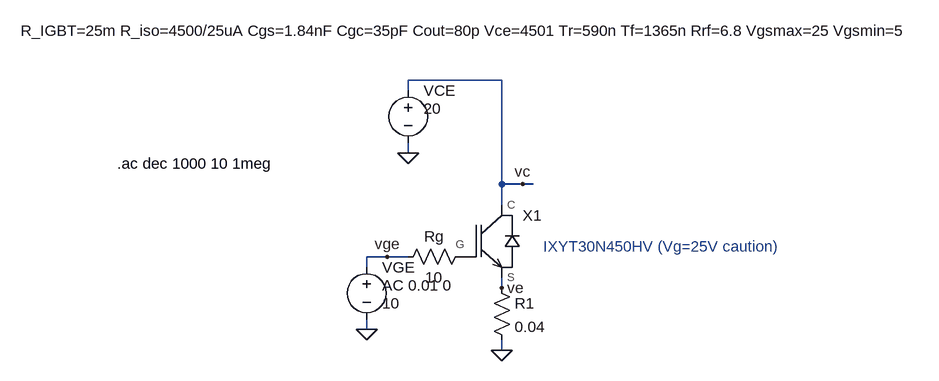
[diagram p0: schematic analisis_AC_IGBT.asc]
analisis_AC_IGBT.asc, the LTspice schematic file:
Version 4
SHEET 1 2256 680
WIRE 672 -112 528 -112
WIRE 528 -96 528 -112
WIRE 528 0 528 -16
WIRE 672 48 672 -112
WIRE 704 48 672 48
WIRE 720 48 704 48
WIRE 672 80 672 48
WIRE 496 160 464 160
WIRE 528 160 496 160
WIRE 464 176 464 160
WIRE 672 208 672 192
WIRE 464 272 464 256
WIRE 672 304 672 288
FLAG 528 0 0
FLAG 672 304 0
FLAG 464 272 0
FLAG 496 160 vge
FLAG 704 48 vc
FLAG 672 208 ve
SYMBOL voltage 464 160 R0
WINDOW 123 24 44 Left 2
WINDOW 39 0 0 Left 0
WINDOW 3 24 72 Left 2
SYMATTR Value2 AC 0.01 0
SYMATTR InstName VGE
SYMATTR Value 10
SYMBOL voltage 528 -112 R0
WINDOW 3 24 44 Left 2
WINDOW 123 0 0 Left 0
WINDOW 39 0 0 Left 0
SYMATTR Value 20
SYMATTR InstName VCE
SYMBOL IGBT_model 640 176 R0
WINDOW 39 -708 -364 Left 2
SYMATTR SpiceLine R_IGBT=25m R_iso=4500/25uA Cgs=1.84nF Cgc=35pF Cout=80p Vce=4501 Tr=590n Tf=1365n Rrf=6.8 Vgsmax=25 Vgsmin=5
SYMATTR InstName X1
SYMBOL res 624 144 R90
WINDOW 0 0 56 VBottom 2
WINDOW 3 32 56 VTop 2
SYMATTR InstName Rg
SYMATTR Value 10
SYMBOL res 656 192 R0
SYMATTR InstName R1
SYMATTR Value 0.04
TEXT 736 144 Left 2 ;IXYT30N450HV (Vg=25V caution)
TEXT 80 16 Left 2 !.ac dec 1000 10 1meg

The netlist it stands for:
* analisis_AC_IGBT.asc
VGE vge 0 10 AC 0.01 0
VCE vc 0 20
XX1 vc P001 ve IGBT_model params: R_IGBT=25m R_iso=4500/25uA Cgs=1.84nF Cgc=35pF Cout=80p Vce=4501 Tr=590n Tf=1365n Rrf=6.8 Vgsmax=25 Vgsmin=5  ; pins C G S
Rg P001 vge 10
R1 ve 0 0.04
* IXYT30N450HV (Vg=25V caution)
.ac dec 1000 10 1meg
.backanno
.end

* Results of the author's LTspice run, read from the files saved beside the schematic
* Operating Point, zero values left out:
*   V(vge) = 10 V
*   V(vc) = 20 V
*   V(ve) = 2.889 V
*   V(p001) = 10 V
*   I(R1) = 72.23 A
*   I(Vce) = -72.23 A
*   Ix(x1:C) = 72.23 A
*   Ix(x1:S) = -72.23 A
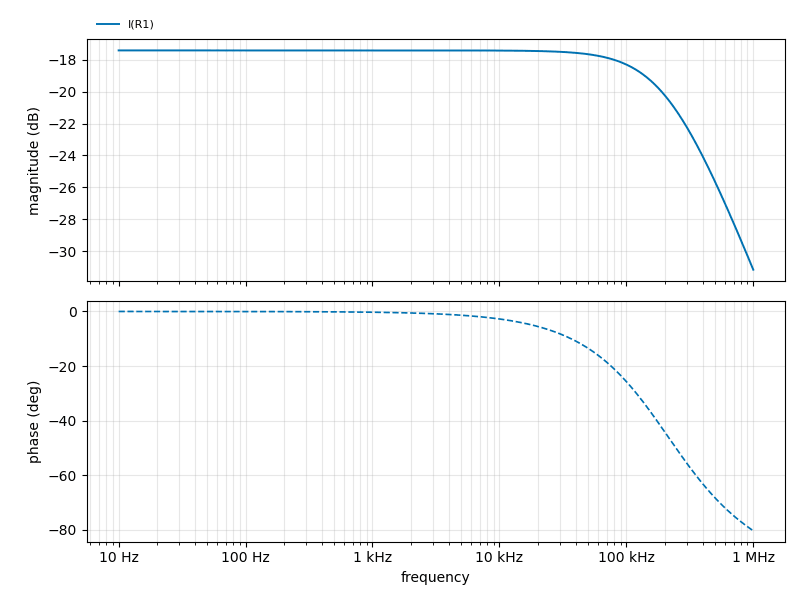
[diagram p1: AC Analysis of analisis_AC_IGBT.asc, plotted from the saved traces]
* AC Analysis, 1 run:
*   I(R1): -17.40 dB at 10 Hz, -31.17 dB at 1 MHz, peak -17.40 dB at 10 Hz, 3 dB below the peak at 209.9 kHz